# Altium schematic sheet 电源.SchDoc
size A4; DocumentNumber: 2; SheetNumber: 3; SheetTotal: 3
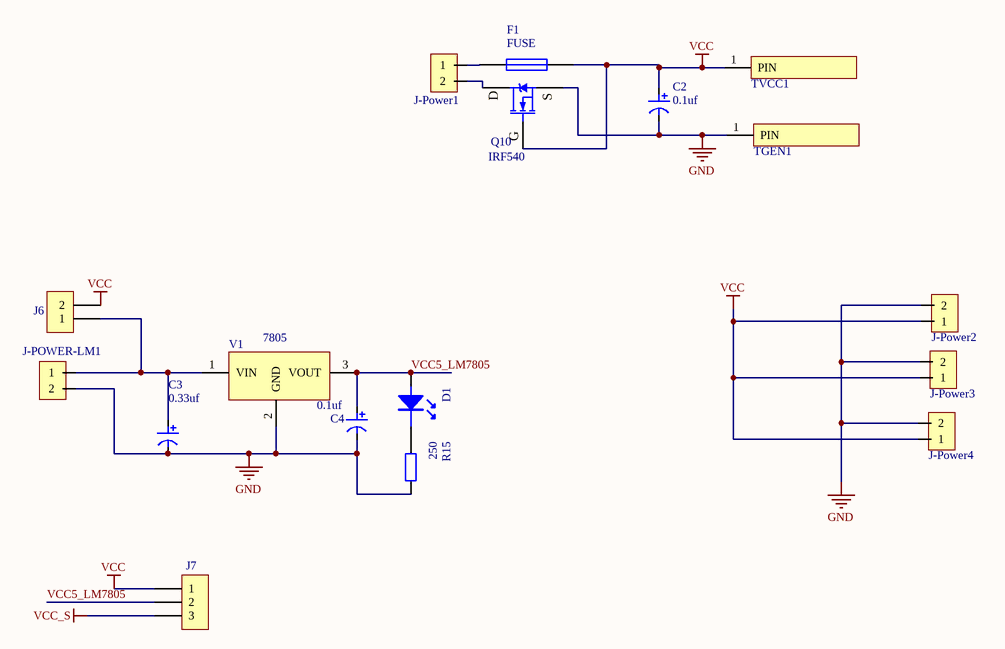
[diagram p0: 电源.SchDoc]

## Parts
C2  0.1uf  [CE5-6R5X5-1mm]
C3  0.33uf  [CE5-6R5X5-1mm]
C4  0.1uf  [CE5-6R5X5-1mm]
D1  333-2SYGD/S530-E2  [LED2-D5R9X8R7]  (value not drawn)
F1  FUSE  [FUSE-24R1X3RX29R7-TH]
J6  PAS1251-0201A01B1BA  [CON2P-2R54-TH]  (value not drawn)
J7  PAS1251-0301A01B1BA  [CON3P-2R54-TH]  (value not drawn)
J-Power1  KF301-5.08-2p  [KF301-5.0-2P]  (value not drawn)
J-Power2  KF301-5.08-2p  [KF301-5.0-2P]  (value not drawn)
J-Power3  KF301-5.08-2p  [KF301-5.0-2P]  (value not drawn)
J-Power4  KF301-5.08-2p  [KF301-5.0-2P]  (value not drawn)
J-POWER-LM1  KF301-5.08-2p  [KF301-5.0-2P]  (value not drawn)
Q10  IRF540  [TO220A]
R15  250  [RY0R25W]
TGEN1  T？  [铺铜条]  (value not drawn)
TVCC1  T？  [铺铜条]  (value not drawn)
V1  7805  [TO220A]

## Nets
GND: C2.2 C3.2 C4.2 J-Power2.2 J-Power3.2 J-Power4.2 J-POWER-LM1.2 Q10.3(S) R15.2 TGEN1.1(PIN) V1.2(GND)
VCC: C2.1 F1.2 J6.2 J7.1 J-Power2.1 J-Power3.1 J-Power4.1 Q10.1(G) TVCC1.1(PIN)
VCC_S: J7.3
VCC5_LM7805: C4.1 D1.1 J7.2 V1.3(VOUT)
NetC3_1: C3.1 J6.1 J-POWER-LM1.1 V1.1(VIN)
NetD1_2: D1.2 R15.1
NetF1_1: F1.1 J-Power1.1
NetJ-Power1_2: J-Power1.2 Q10.2(D)

## Library data of the parts
C2-C4 = 102CB-00002OD.01: DIP,电容量681pf,额定电压2000V,偏差±10%,6.5X5mm; Allow Altenative Part: Y; serial number: 14; Categories: 电容; Value: 681pF; Tolerance: ±10%; Rated Voltage: 2000V; COMPONENTLINK 1 DESCRIPTION: ShowDatasheet; Remark: Verified by BU1（黄雄青） check list V1.0; Modify time: 2015年11月05号; Approved: YES; Part Number: 102CB-00002OD.01; Category: 陶瓷电容; Operating Temperature: -25°C~105°C; PACKAGE: Bulk; Mounting Type: ThroughHole; Applications: Automotive; Size: 6.5; Max Thickness: 5; Supplier 1: TDK; Supplier Part Number 1: CK45-B3DD681KYLR; Pricing 1: 0.7242; COMPONENTLINK 1 URL: http://pdf-file.ic37.com/pdf6/TDK/CK45-B3DD222KYNA_datasheet_1118532/182787/CK45-B_datasheet.pdf; MOQ: 1000
D1 = 102DL-00010CH.01: DIP,封装/间距直径5/2.54mm,额定电压2V,亮度普亮,绿色; Allow Altenative Part: Y; serial number: 4; Categories: 二极管; Rated Voltage: 2V; COMPONENTLINK 1 DESCRIPTION: GetDatasheet; Remark: Verified by CRD（张宗良） check list V1.0; Modify time: 2015年11月11号; Approved: YES; Part Number: 102DL-00010CH.01; Category: 发光二极管; Value: 333-2SYGD/S530-E2; Other: 绿色; PACKAGE: Bulk; Mounting Type: ThroughHole; Supplier 1: 台湾亿光; Supplier Part Number 1: 333-2SYGD/S530-E2; Pricing 1: .3619; COMPONENTLINK 1 URL: http://www.everlight.com/file/ProductFile/201407052217358844.pdf; MOQ: 4000
F1 = 102FP-00037BI.01: DIP,24.1x29.7x3.0mm,额定电压30V,额定电流9A,触发电流18A,中速断; Allow Altenative Part: Y; serial number: 2; Categories: 保险丝; Value: R30-900; Rated Voltage: 30V; Rated Current: 9A; COMPONENTLINK 1 DESCRIPTION: GetDatasheet; Remark: Verified by BU1（黄雄青） check list V1.0; Modify time: 2015年07月10号; Approved: YES; Part Number: 102FP-00037BI.01; Category: 自恢复保险丝; PACKAGE: Bulk; Mounting Type: ThroughHole; Supplier 1: SEA&LAND; Supplier Part Number 1: R30-900; Pricing 1: .4; COMPONENTLINK 1 URL: http://www.littelfuse.name/te_product_d_c914/2013-10-18/7630.chtml; MOQ: 500
J6 = 102NL-00005DJ.01: DIP,封装脚距2.54mm,180度,1x2PIN,上针/下针6.0/3.0mm,黑色; Allow Altenative Part: Y; serial number: 286; Categories: 连接器; COMPONENTLINK 1 DESCRIPTION: GetDatasheet; Remark: Verified by BU2（叶俊雄） check list V1.0; Modify time: 2016年08月22号; Approved: YES; Part Number: 102NL-00005DJ.01; Category: 单排针; Value: PAS1251-0201A01B1BA; PACKAGE: Bulk; Mounting Type: ThroughHole; Supplier 1: 骏佳; Supplier Part Number 1: PAS1251-0201A01B1BA; Pricing 1: .03; COMPONENTLINK 1 URL: http://www.hkjb888.com/product.asp?action=detailed&id=1099&page=3&pid=245; MOQ: 500
J7 = 102NL-00001DJ.01: DIP,封装脚距2.54mm,180度,1x3PIN,黑色; Allow Altenative Part: Y; serial number: 168; Categories: 连接器; COMPONENTLINK 1 DESCRIPTION: GetDatasheet; Remark: Verified by CRD（赖程奇） check list V1.0; Modify time: 2016年1月11号; Approved: YES; Part Number: 102NL-00001DJ.01; Category: 单排针; Value: PAS1251-0301A01B1BA; PACKAGE: Bulk; Mounting Type: ThroughHole; Supplier 1: 骏佳; Supplier Part Number 1: PAS1251-0301A01B1BA; Pricing 1: 2.05; COMPONENTLINK 1 URL: http://www.hkjb888.com/product.asp?page=7; MOQ: 100
J-Power1-J-Power4 J-POWER-LM1 = KF301
Q10 = IRF840: N沟场效应管; 版权归属: 源创客; BOM名称: N沟场效应管; 学习资源: www.ooocke.com
R15 = 102RO-00087BS.01: DIP,阻值500R,精度±0.1%,4.75x1.65mm,额定功率1/4W; Allow Altenative Part: Y; serial number: 14; Categories: 电阻; Value: 500R; Tolerance: ±0.1%; Rated Power: 1/4W; COMPONENTLINK 1 DESCRIPTION: OpenDatasheet; Remark: Verified by BU3（吴明徽）check list V1.0; Modify time: 2015年11月30号; Approved: YES; Part Number: 102RO-00087BS.01; Category: 功率电阻; PACKAGE: Bulk; Mounting Type: ThroughHole; Size: 1.65x4.75mm; Supplier 1: Vishay; Supplier Part Number 1: CMF50500R00BKRE; Pricing 1: 1.29322; COMPONENTLINK 1 URL: http://www.vishay.com/docs/31018/cmfind.pdf; MOQ: 1000
TGEN1 TVCC1 = 铺铜条: 2mm*20的铜条用于焊接
V1 = 78xx: 线性稳压芯片; 版权归属: 源创客; BOM名称: 线性稳压芯片; 学习资源: www.ooocke.com